# EAGLE schematic diagrams for fyp (EAGLE 9.0.1)
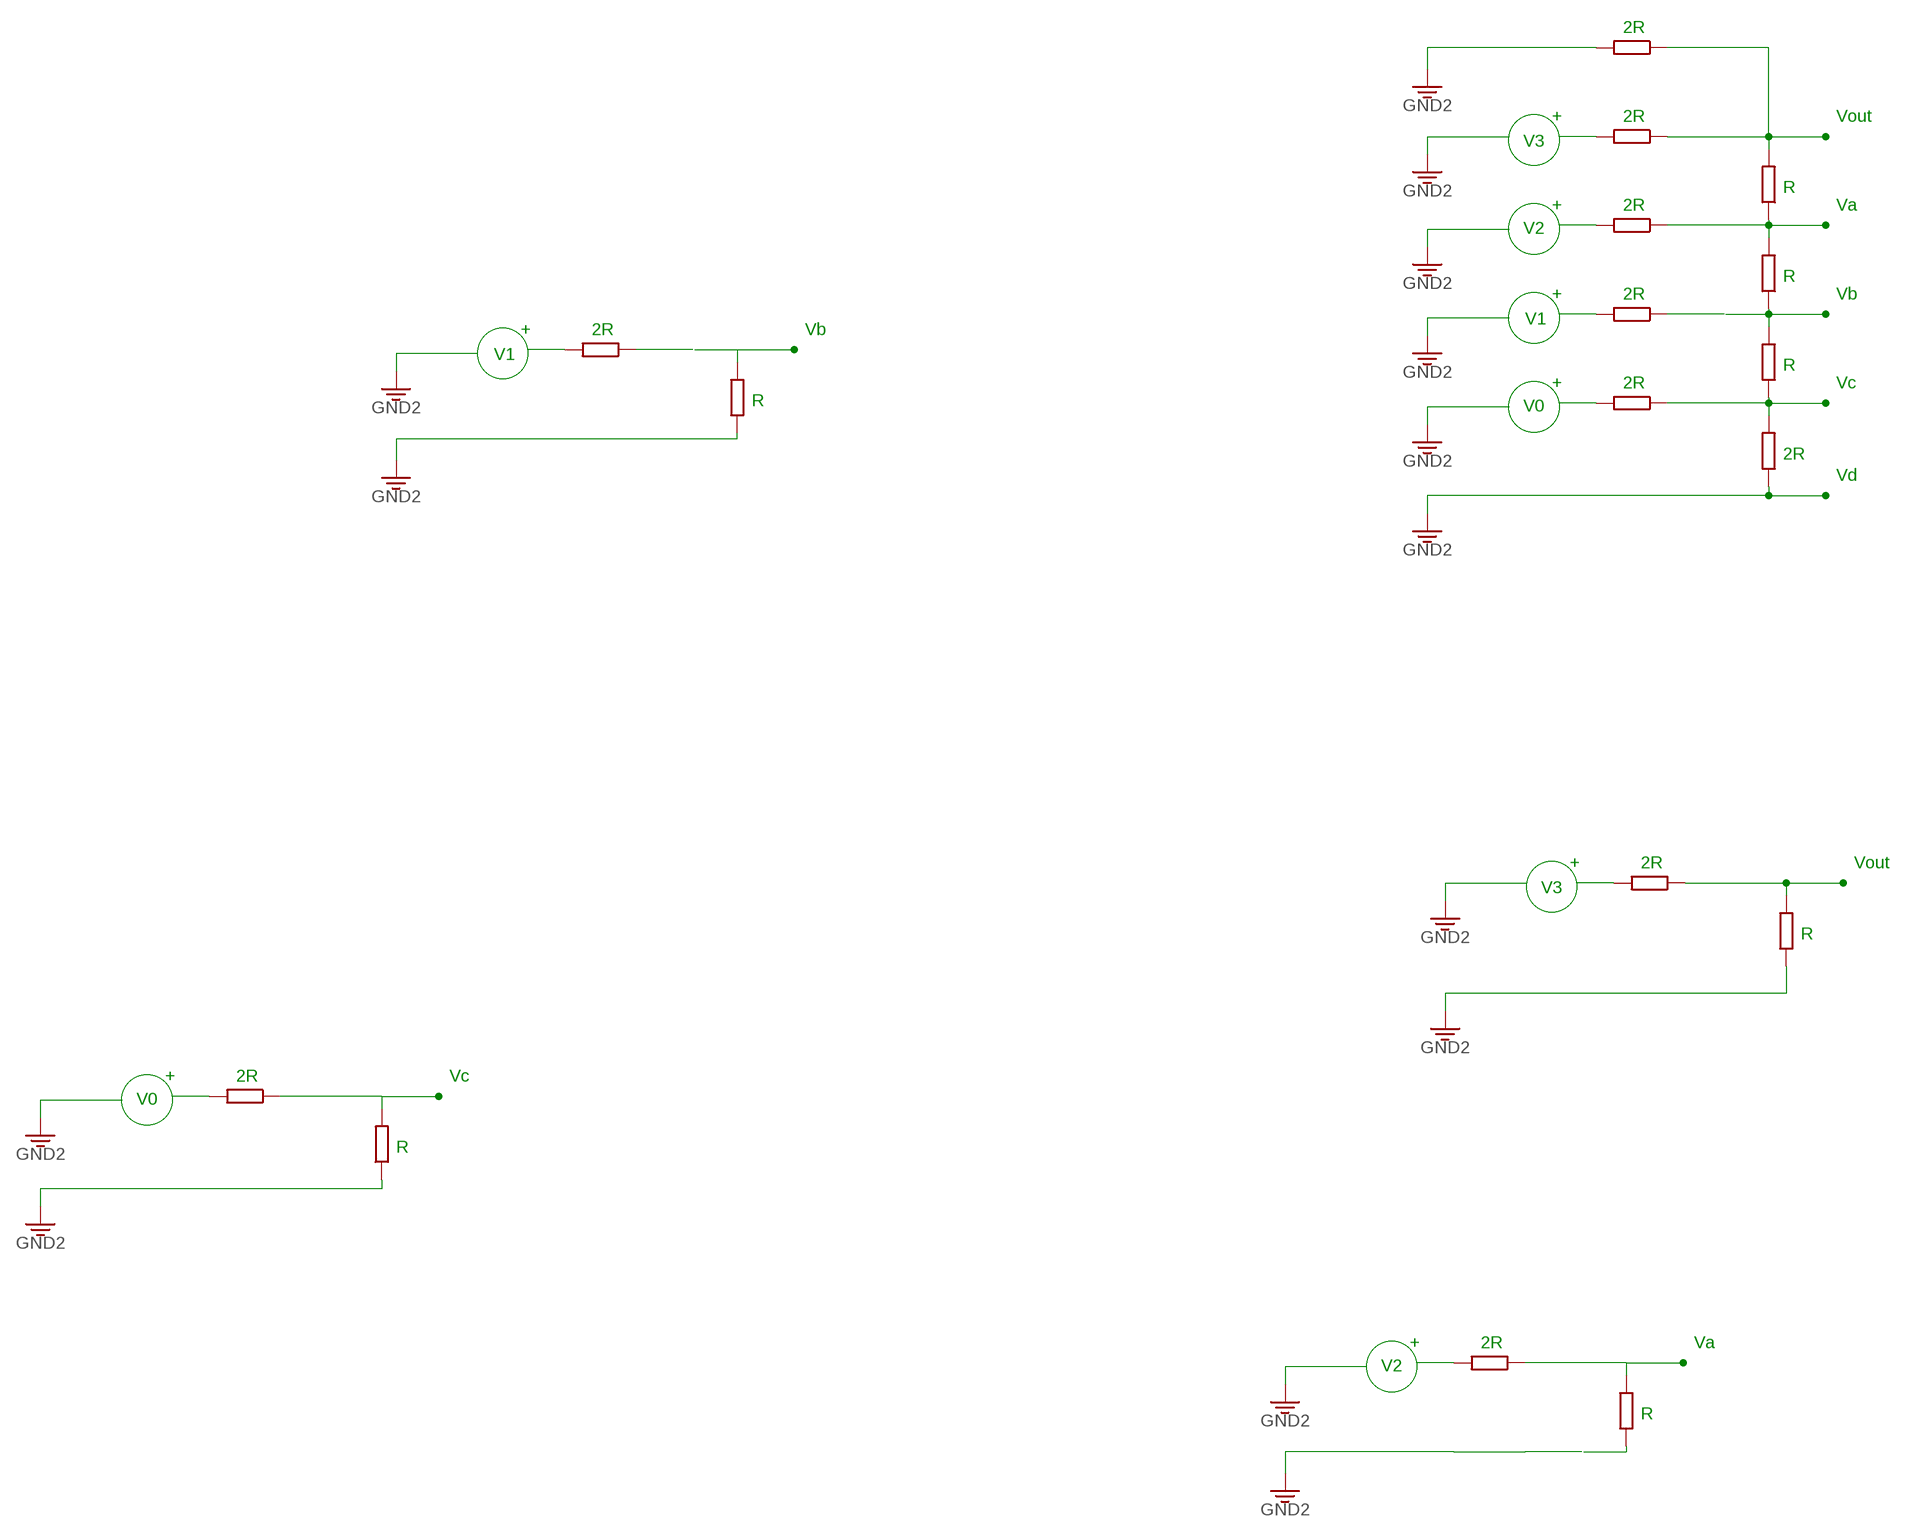
[diagram p0: schematic, sheet 1, part 1 of 2]
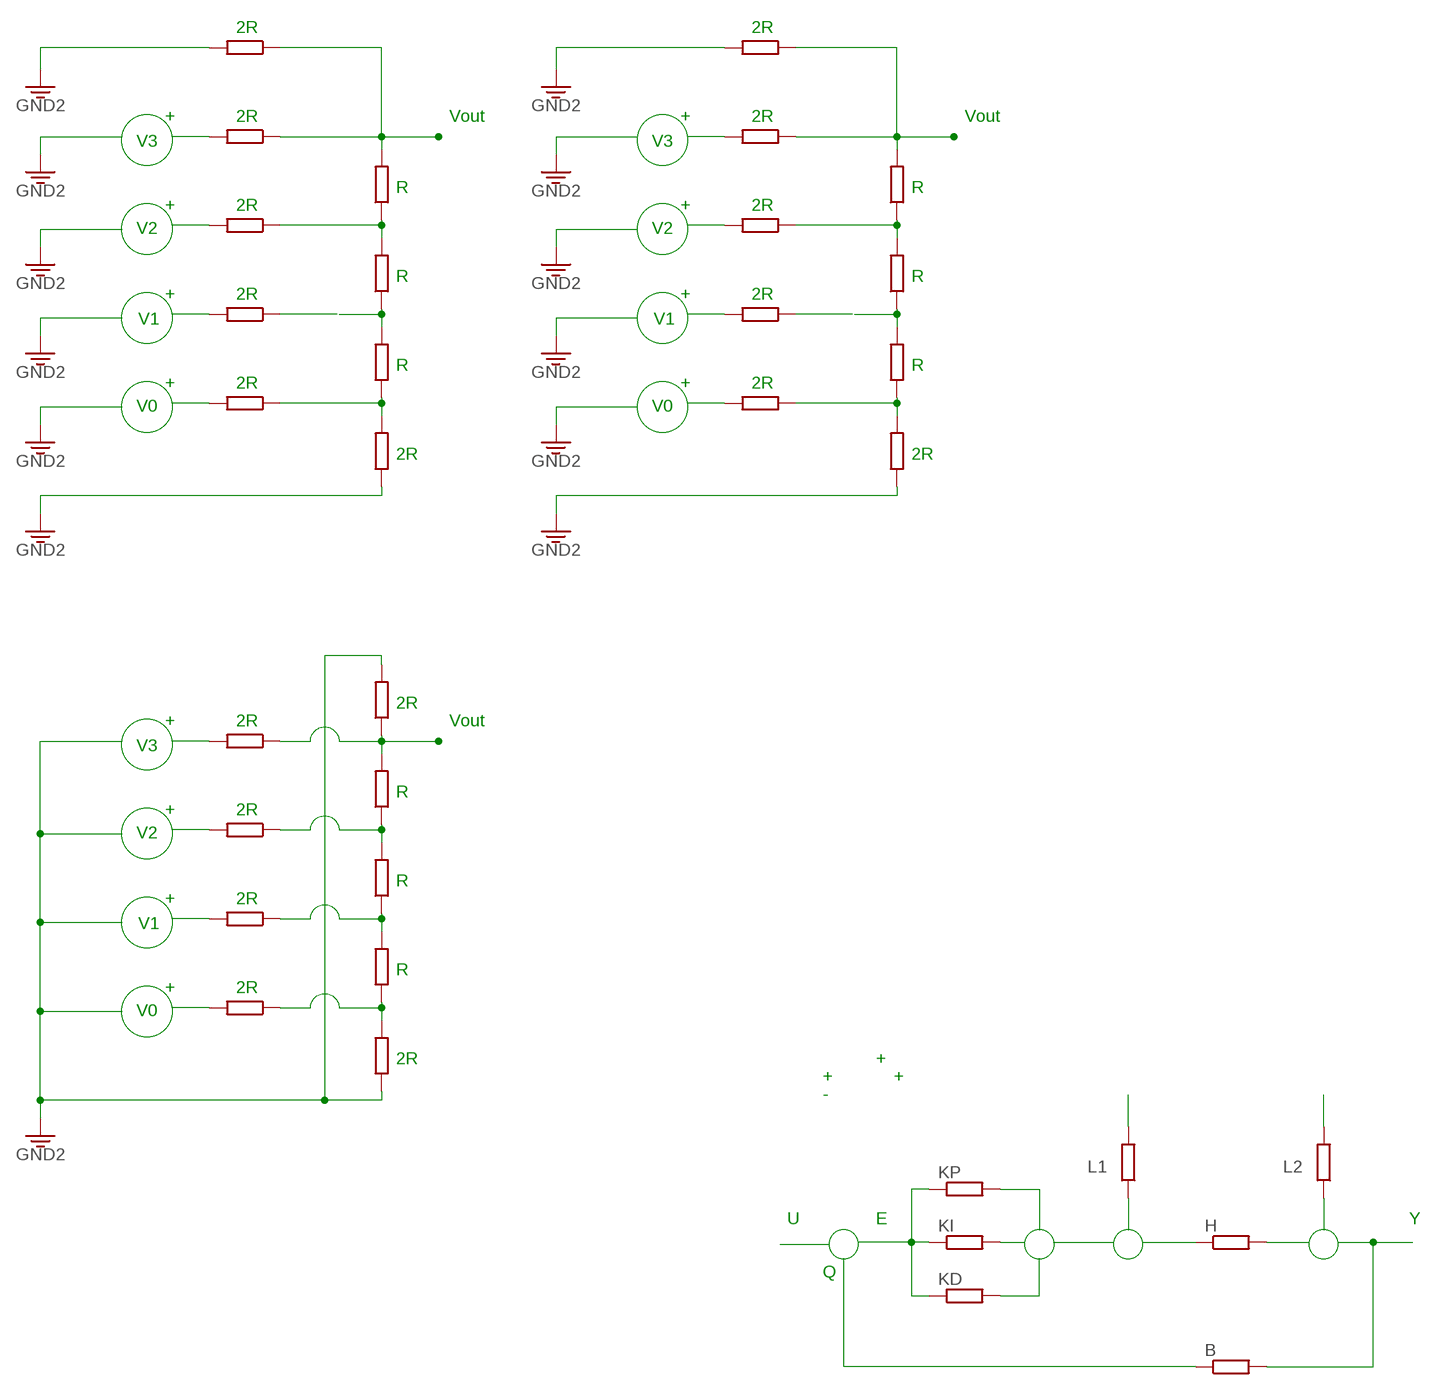
[diagram p1: schematic, sheet 1, part 2 of 2]

## Parts
B  R-EU_0204/2V  [0204V]
H  R-EU_0204/2V  [0204V]
KD  R-EU_0204/2V  [0204V]
KI  R-EU_0204/2V  [0204V]
KP  R-EU_0204/2V  [0204V]
L1  R-EU_0204/2V  [0204V]
L2  R-EU_0204/2V  [0204V]
R1  R-EU_0204/2V  [0204V]
R2  R-EU_0204/2V  [0204V]
R3  R-EU_0204/2V  [0204V]
R4  R-EU_0204/2V  [0204V]
R5  R-EU_0204/2V  [0204V]
R6  R-EU_0204/2V  [0204V]
R7  R-EU_0204/2V  [0204V]
R8  R-EU_0204/2V  [0204V]
R9  R-EU_0204/2V  [0204V]
R10  R-EU_0204/2V  [0204V]
R11  R-EU_0204/2V  [0204V]
R12  R-EU_0204/2V  [0204V]
R13  R-EU_0204/2V  [0204V]
R14  R-EU_0204/2V  [0204V]
R15  R-EU_0204/2V  [0204V]
R16  R-EU_0204/2V  [0204V]
R17  R-EU_0204/2V  [0204V]
R18  R-EU_0204/2V  [0204V]
R19  R-EU_0204/2V  [0204V]
R20  R-EU_0204/2V  [0204V]
R21  R-EU_0204/2V  [0204V]
R22  R-EU_0204/2V  [0204V]
R23  R-EU_0204/2V  [0204V]
R24  R-EU_0204/2V  [0204V]
R25  R-EU_0204/2V  [0204V]
R26  R-EU_0204/2V  [0204V]
R27  R-EU_0204/2V  [0204V]
R28  R-EU_0204/2V  [0204V]
R29  R-EU_0204/2V  [0204V]
R30  R-EU_0204/2V  [0204V]
R31  R-EU_0204/2V  [0204V]
R32  R-EU_0204/2V  [0204V]
R33  R-EU_0204/2V  [0204V]
R34  R-EU_0204/2V  [0204V]
R35  R-EU_0204/2V  [0204V]
R36  R-EU_0204/2V  [0204V]
R37  R-EU_0204/2V  [0204V]
R38  R-EU_0204/2V  [0204V]
R39  R-EU_0204/2V  [0204V]
R40  R-EU_0204/2V  [0204V]
R41  R-EU_0204/2V  [0204V]
R44  R-EU_0204/2V  [0204V]
R45  R-EU_0204/2V  [0204V]
R48  R-EU_0204/2V  [0204V]

## Nets
3.3V: R5.2 R7.1 R15.1 R24.1 R36.1 R41.1 R48.1 ; supply symbol labelled GND2
N$2: KI.2
N$3: L1.1
N$4: H.2
N$5: L2.1
N$6: KP.2
N$7: KD.2
N$8: KD.1 KI.1 KP.1
N$9: B.1
N$11: L2.2
N$12: B.2
N$13: L1.2
N$14: H.1
N$15: R11.1 R14.1 R17.2
N$16: R1.1 R6.1 R9.2
N$17: R2.2 R4.1 R9.1
N$18: R2.1 R3.1 R7.2
N$19: R10.2 R17.1
N$20: R1.2
N$21: R4.2
N$22: R3.2
N$23: R8.2
N$24: R5.1 R6.2 R8.1
N$25: R10.1 R12.1 R15.2
N$26: R11.2
N$27: R13.2
N$28: R12.2
N$29: R16.2
N$30: R14.2 R16.1 R18.1
N$31: R13.1
N$32: R18.2
N$37: R20.1 R23.1 R26.2
N$38: R19.2 R26.1
N$39: R19.1 R21.1 R24.2
N$40: R20.2
N$41: R22.2
N$42: R21.2
N$43: R25.2
N$44: R23.2 R25.1 R27.1
N$45: R22.1
N$46: R27.2
N$51: R29.1 R37.2
N$53: R37.1
N$55: R29.2
N$56: R30.1 R35.1 R39.2
N$57: R34.2
N$58: R32.2 R34.1
N$59: R28.2 R39.1
N$60: R28.1 R31.1 R36.2
N$62: R30.2
N$63: R33.2
N$64: R31.2
N$65: R38.2
N$67: R35.2 R38.1 R40.1
N$68: R33.1
N$69: R40.2
N$80: R41.2
N$83: R44.2
N$84: R45.1 R48.2
N$87: R44.1
N$88: R45.2
Unconnected: R32.1

## Notes on the sheet
- 2R
- + | 2R | Vout
- V3
- R
- + | 2R | Va
- V2
- R
- + | 2R | Vb
- V1
- + | 2R | Vb
- V1
- R
- + | 2R | Vc
- R
- V0
- 2R
- Vd
- 2R | 2R
- + | 2R | Vout | + | 2R | Vout
- + | 2R | Vout
- V3 | V3
- V3
- R | R
- R | + | 2R | + | 2R
- V2 | V2
- R | R
- + | 2R | + | 2R
- V1 | V1
- + | 2R | Vc
- R | R
- V0
- + | 2R | + | 2R
- V0 | V0
- R
- 2R | 2R
- + | 2R | Va
- V2
- R
- 2R
- + | 2R | Vout
- V3
- R
- + | 2R
- V2
- R
- + | 2R
- V1
- R
- + | 2R
- V0
- 2R | +
- + | +
- -
- U | E | Y
- Q

## Library data of the parts
B H KD KI KP L1 L2 R1-R41 R44 R45 R48 = resistor:R-EU_: RESISTOR, European symbol